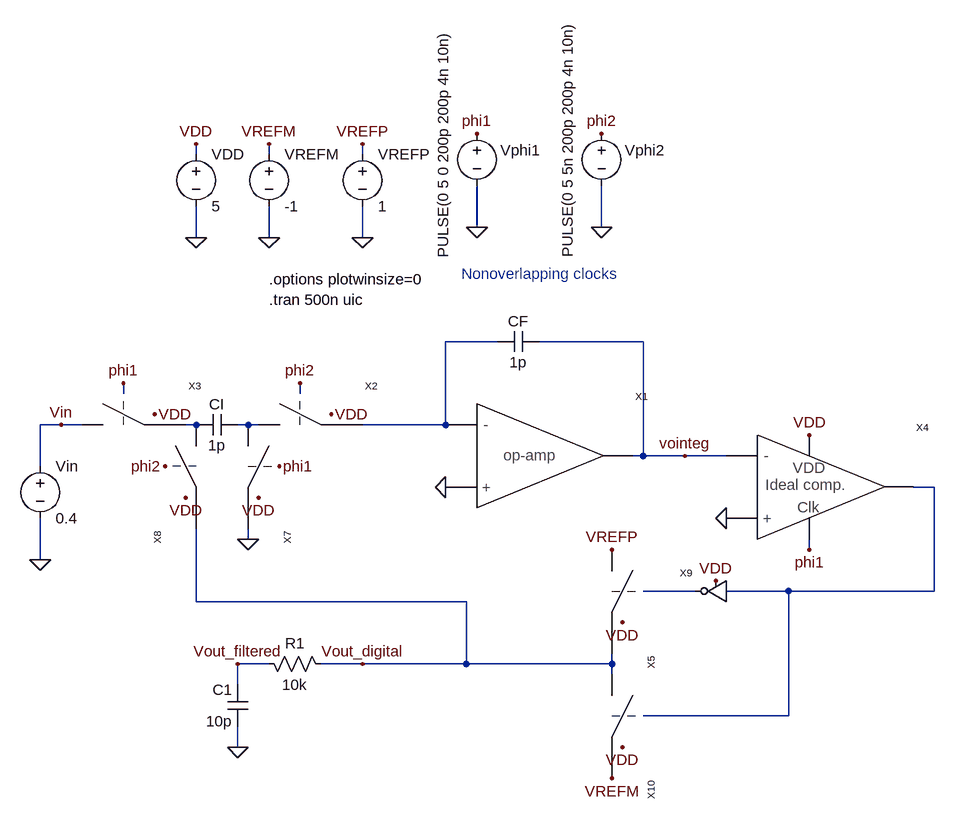
[diagram p0: schematic Fig29_48.asc]
Fig29_48.asc, the LTspice schematic file:
Version 4
SHEET 1 2740 696
WIRE 944 -784 944 -800
WIRE 1056 -784 1056 -800
WIRE 1200 -784 1200 -800
WIRE 1376 -672 1376 -736
WIRE 1568 -672 1568 -736
WIRE 944 -656 944 -704
WIRE 1056 -656 1056 -704
WIRE 1200 -656 1200 -704
WIRE 1408 -496 1328 -496
WIRE 1632 -496 1472 -496
WIRE 832 -416 832 -432
WIRE 1104 -416 1104 -432
WIRE 736 -368 704 -368
WIRE 768 -368 736 -368
WIRE 944 -368 928 -368
WIRE 1024 -368 1008 -368
WIRE 1040 -368 1024 -368
WIRE 1328 -368 1328 -496
WIRE 1328 -368 1200 -368
WIRE 1632 -320 1632 -496
WIRE 1632 -320 1616 -320
WIRE 1696 -320 1632 -320
WIRE 1760 -320 1696 -320
WIRE 704 -304 704 -368
WIRE 2080 -272 2048 -272
WIRE 1024 -192 1024 -208
WIRE 1888 -176 1888 -192
WIRE 704 -160 704 -224
WIRE 1712 -112 1632 -112
WIRE 1856 -112 1760 -112
WIRE 2080 -112 2080 -272
WIRE 2080 -112 1856 -112
WIRE 944 -96 944 -208
WIRE 1360 -96 944 -96
WIRE 1056 0 1008 0
WIRE 1200 0 1136 0
WIRE 1360 0 1360 -96
WIRE 1360 0 1200 0
WIRE 1584 0 1584 -16
WIRE 1584 0 1360 0
WIRE 1584 16 1584 0
WIRE 1008 32 1008 0
WIRE 1856 80 1856 -112
WIRE 1856 80 1632 80
WIRE 1008 128 1008 96
FLAG 704 -160 0
FLAG 736 -368 Vin
FLAG 1376 -672 0
FLAG 1376 -816 phi1
FLAG 944 -656 0
FLAG 944 -800 VDD
FLAG 1152 -384 VDD
FLAG 832 -432 phi1
FLAG 1104 -432 phi2
FLAG 1568 -672 0
FLAG 1568 -816 phi2
FLAG 1888 -352 VDD
FLAG 1888 -176 phi1
FLAG 1200 0 Vout_digital
FLAG 1696 -320 vointeg
FLAG 1040 -256 VDD
FLAG 880 -384 VDD
FLAG 928 -256 VDD
FLAG 896 -304 phi2
FLAG 1072 -304 phi1
FLAG 1600 -64 VDD
FLAG 1744 -128 VDD
FLAG 1600 128 VDD
FLAG 1008 128 0
FLAG 1008 0 Vout_filtered
FLAG 1584 -176 VREFP
FLAG 1584 176 VREFM
FLAG 1056 -656 0
FLAG 1056 -800 VREFM
FLAG 1200 -656 0
FLAG 1200 -800 VREFP
FLAG 1328 -272 0
FLAG 1760 -224 0
FLAG 1024 -192 0
SYMBOL voltage 704 -320 R0
WINDOW 123 0 0 Left 0
WINDOW 39 0 0 Left 0
SYMATTR InstName Vin
SYMATTR Value 0.4
SYMBOL voltage 1376 -832 R0
WINDOW 0 36 42 Left 0
WINDOW 3 -52 207 VLeft 0
WINDOW 123 0 0 Left 0
WINDOW 39 0 0 Left 0
SYMATTR InstName Vphi1
SYMATTR Value PULSE(0 5 0 200p 200p 4n 10n)
SYMBOL voltage 944 -800 R0
WINDOW 123 0 0 Left 0
WINDOW 39 0 0 Left 0
SYMATTR InstName VDD
SYMATTR Value 5
SYMBOL cap 1408 -480 R270
WINDOW 0 32 32 VTop 0
WINDOW 3 0 32 VBottom 0
SYMATTR InstName CF
SYMATTR Value 1p
SYMBOL cap 1008 -384 R90
WINDOW 0 0 32 VBottom 0
WINDOW 3 32 32 VTop 0
SYMATTR InstName CI
SYMATTR Value 1p
SYMBOL voltage 1568 -832 R0
WINDOW 0 36 42 Left 0
WINDOW 3 -52 207 VLeft 0
WINDOW 123 0 0 Left 0
WINDOW 39 0 0 Left 0
SYMATTR InstName Vphi2
SYMATTR Value PULSE(0 5 5n 200p 200p 4n 10n)
SYMBOL Ideal_clocked_comparator 1808 -272 R0
SYMATTR InstName X4
SYMBOL op_amp 1376 -320 R0
SYMATTR InstName X1
SYMBOL switch_1 1040 -352 R0
SYMATTR InstName X2
SYMBOL switch_1 768 -352 R0
SYMATTR InstName X3
SYMBOL switch_1 1008 -368 R90
SYMATTR InstName X7
SYMBOL switch_1 960 -368 M90
SYMATTR InstName X8
SYMBOL switch_1 1568 -176 R90
SYMATTR InstName X5
SYMBOL inverter 1760 -112 M0
SYMATTR InstName X9
SYMBOL switch_1 1568 16 R90
SYMATTR InstName X10
SYMBOL res 1152 16 M270
WINDOW 0 32 56 VTop 0
WINDOW 3 0 56 VBottom 0
SYMATTR InstName R1
SYMATTR Value 10k
SYMBOL cap 1024 32 M0
SYMATTR InstName C1
SYMATTR Value 10p
SYMBOL voltage 1200 -800 R0
WINDOW 123 0 0 Left 0
WINDOW 39 0 0 Left 0
SYMATTR InstName VREFP
SYMATTR Value 1
SYMBOL voltage 1056 -800 R0
WINDOW 123 0 0 Left 0
WINDOW 39 0 0 Left 0
SYMATTR InstName VREFM
SYMATTR Value -1
TEXT 1056 -560 Left 0 !.tran 500n uic
TEXT 1352 -600 Left 0 ;Nonoverlapping clocks
TEXT 1056 -592 Left 0 !.options plotwinsize=0

The netlist it stands for:
* Fig29_48.asc
Vin Vin 0 0.4
Vphi1 phi1 0 PULSE(0 5 0 200p 200p 4n 10n)
VDD VDD 0 5
CF N001 vointeg 1p
CI N003 N002 1p
Vphi2 phi2 0 PULSE(0 5 5n 200p 200p 4n 10n)
XX4 vointeg 0 N004 VDD phi1 Ideal_clocked_comparator  ; pins Vinm Vinp Vout VDD Clock
XX1 N001 0 vointeg op_amp  ; pins Vinm Vinp Out
XX2 N003 N001 phi2 VDD switch_1  ; pins P1 P2 clk VDD
XX3 Vin N002 phi1 VDD switch_1  ; pins P1 P2 clk VDD
XX7 N003 0 phi1 VDD switch_1  ; pins P1 P2 clk VDD
XX8 N002 Vout_digital phi2 VDD switch_1  ; pins P1 P2 clk VDD
XX5 VREFP Vout_digital N005 VDD switch_1  ; pins P1 P2 clk VDD
XX9 N004 N005 VDD inverter  ; pins In Out VDD
XX10 Vout_digital VREFM N004 VDD switch_1  ; pins P1 P2 clk VDD
R1 Vout_digital Vout_filtered 10k
C1 Vout_filtered 0 10p
VREFP VREFP 0 1
VREFM VREFM 0 -1
.tran 500n uic
* Nonoverlapping clocks
.options plotwinsize=0
.backanno
.end